# EAGLE design bike-blinky (EAGLE 6.4)
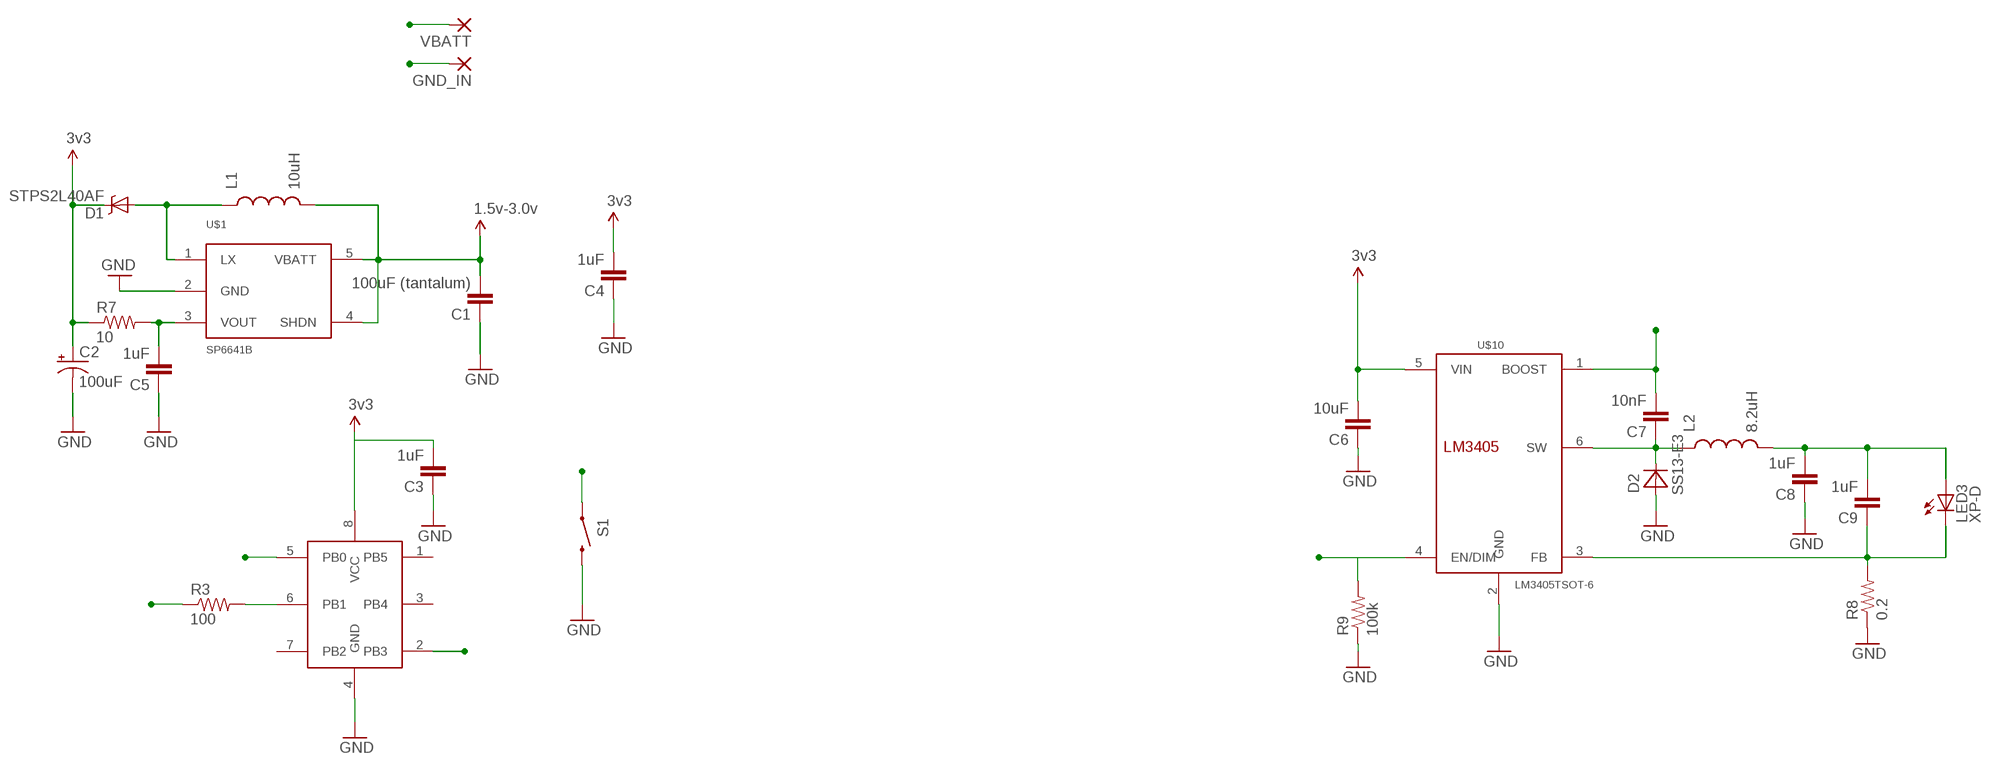
[diagram p0: schematic, sheet 1]

## Parts
C1  100uF (tantalum)  CAP1206  [1206]
C2  100uF  CAP_POLC  [PANASONIC_C]
C3  1uF  CAP0603-CAP  [0603-CAP]
C4  1uF  CAP0603-CAP  [0603-CAP]
C5  1uF  CAP0603-CAP  [0603-CAP]
C6  10uF  CAP1206  [1206]
C7  10nF  CAP0603-CAP  [0603-CAP]
C8  1uF  CAP0603-CAP  [0603-CAP]
C9  1uF  CAP0603-CAP  [0603-CAP]
D1  STPS2L40AF  MBRA140  [SMA-DIODE]
D2  SS13-E3  MBRA340T3  [SMA]
GND_IN  WIREPAD2,54/1,0  [2,54/1,0]
L1  10uH  INDUCTOR1007  [1007]
L2  8.2uH  INDUCTOR1210  [1210]
LED3  XP-D  XLAMP-XB-D-LED  [XB-D-REV1]
R3  100  RESISTOR0603-RES  [0603-RES]
R7  10  RESISTOR0603-RES  [0603-RES]
R8  0.2  RESISTOR2010  [R2010]
R9  100k  RESISTOR0603-RES  [0603-RES]
S1  SWITCH-MOMENTARY-2SMD-2  [TACTILE_SWITCH_SMD-2]
U$1  SP6641B  SP6641SP6641A/B  [SOT23-5]
U$2  ATTINY13  [WSOIC-8]
U$10  LM3405TSOT-6  [TSOT-6]
VBATT  WIREPAD2,54/1,0  [2,54/1,0]

## Nets
5V: C2.+ C3.2 C4.2 C6.2 D1.C R7.1 U$2.8(VCC) U$10.5(VIN) ; supply symbol labelled 3v3
ENABLE: C7.2 U$2.2(PB3) U$10.1(BOOST)
GND: C1.1 C2.- C3.1 C4.1 C5.1 C6.1 C8.1 D2.A GND_IN.1(P) R8.1 R9.1 S1.1 U$1.2(GND) U$2.4(GND) U$10.2(GND)
N$2: R3.2 U$2.6(PB1)
N$3: D1.A L1.1 U$1.1(LX)
N$7: C5.2 R7.2 U$1.3(VOUT)
N$8: C9.1 LED3.C R8.2 U$10.3(FB)
N$12: C7.1 D2.C L2.1 U$10.6(SW)
N$13: C8.2 C9.2 L2.2 LED3.A
RED: R3.1 R9.2 U$10.4(EN/DIM)
SW: S1.2 U$2.5(PB0)
VBATT: C1.2 L1.2 U$1.4(SHDN) U$1.5(VBATT) VBATT.1(P) ; supply symbol labelled 1.5v-3.0v
Unconnected: U$2.1(PB5) U$2.3(PB4) U$2.7(PB2)

## Library data of the parts
C1 C3-C5 = SparkFun:CAP: Capacitor Standard 0603 ceramic capacitor, and 0.1" leaded capacitor.
C2 = SparkFun-Capacitors:CAP_POL: Capacitor Polarized These are standard SMD and PTH capacitors. Normally 10uF, 47uF, and 100uF in electrolytic and tantalum varieties. Always verify the external diameter of the through hole cap, it varies with capacity, voltage, and manufacturer. The EIA devices should be standard.
C6-C9 = SparkFun-Capacitors:CAP: Capacitor Standard 0603 ceramic capacitor, and 0.1" leaded capacitor.
D1 = SparkFun-DiscreteSemi:MBRA140: 40V, 1A Schottky rectifier SMA/DO-214AC package DIO-08053; PROD_ID: DIO-08053
D2 = diode:MBRA340T3: Surface Mount Schottky Power Rectifier Source: http://www.onsemi.com/pub_link/Collateral/MBRA340T3-D.PDF
GND_IN VBATT = wirepad:WIREPAD: Wire PAD connect wire on PCB
L1 L2 = SparkFun-Passives:INDUCTOR: Inductors Basic Inductor/Choke - 0603 and 1206. Footprints are not proven and vary greatly between part numbers.
LED3 = led_cree:XLAMP-XB-D-LED
R3 = SparkFun:RESISTOR: Resistor Basic schematic elements and footprints for 0603, 1206, and PTH resistors.
R7-R9 = SparkFun-Passives:RESISTOR: Resistor Basic schematic elements and footprints for 0603, 1206, and PTH resistors.
S1 = SparkFun-Electromechanical:SWITCH-MOMENTARY-2: Various NO switches- pushbuttons, reed, etc
U$1 = Sipex Custom:SP6641
U$2 = Synapseware:ATTINY13
U$10 = Synapseware:LM3405: LM3405 1.6MHz, 1A Constant Current Buck Regulator for Powering LEDs

## Board
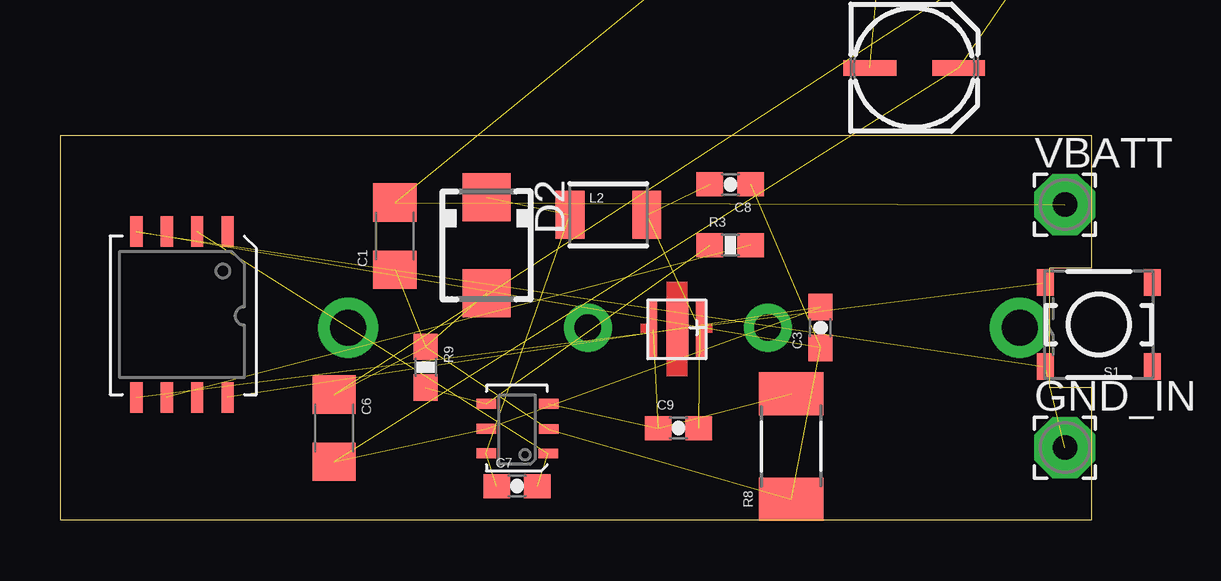
[diagram p1: board, top side]

Size 43.02 x 16.01 mm. Coordinates in mm from the lower left corner, seen from the top.
Outline: 43,16 43,10.5 41.26,10.5 41.26,5.5 43,5.5 43,0 0,0 0,16 43,16
Outline: 43,16 43.02,16.01
Copper layers (1*16): Top 0.035mm / dielectric 1.5mm / Bottom 0.035mm
Design rules "default": minimum track width 10mil, minimum drill 24mil, track to track 8mil, track to pad 8mil, pad to pad 8mil, via to via 8mil, smd to smd 8mil, copper to edge 40mil, drill to drill 8mil, minimum pad ring 10mil, minimum via ring 8mil, stop-mask expansion 4mil, vias tented up to drill 0mil, thermal gap 10mil

### Footprints (pad centres in the part's own frame; a part is rotated, then mirrored left to right if it is on the bottom)
1206 = smd 1.6 x 1.8: 1 -1.4,0; 2 1.4,0
PANASONIC_C = smd 2.2 x 0.65: + 1.9,-0.2; - -1.8,-0.2
0603-CAP = smd 1.1 x 1: 1 -0.85,0; 2 0.85,0
SMA-DIODE = smd 1.27 x 1.47: A -2.15,0; C 2.15,0
SMA = smd 2 x 2: A 2,0; C -2,0
2,54/1,0 = drill 1.016 pad 2.54 octagon: 1 0,0
1007 = smd 2 x 0.8: 1 0,1; 2 0,-1
1210 = smd 1.2 x 2: 1 -1.6,0; 2 1.6,0
XB-D-REV1 = smd 0.36 x 2.34: A 0.935,-0.075; C -1.035,-0.08 | smd 0.92 x 2.34: THERMAL -0.015,-0.075
0603-RES = smd 1.1 x 1: 1 -0.85,0; 2 0.85,0
R2010 = smd 1.8 x 2.7: 1 -2.2,0; 2 2.2,0
TACTILE_SWITCH_SMD-2 = smd 0.7 x 1.1: 1 2.225,1.75; 2 2.225,-1.75; 3 -2.225,-1.75; 4 -2.225,1.75
SOT23-5 = smd 0.7 x 1: 1 0.95,1.2; 2 0,1.2; 3 -0.95,1.2; 4 -1,-1.2; 5 1,-1.2
WSOIC-8 = smd 0.508 x 1.27: 1 -1.855,-3.486; 2 -0.585,-3.486; 3 0.685,-3.486; 4 1.955,-3.486; 5 1.955,3.413; 6 0.685,3.413; 7 -0.585,3.413; 8 -1.855,3.413
TSOT-6 = smd 0.406 x 0.813: 1 -1.06,-1.3; 2 -0.04,-1.32; 3 1.02,-1.32; 4 1.02,1.27; 5 -0.02,1.27; 6 -1.05,1.28

### Placement (x,y rotation side)
C1  13.96,11.81 90 top
C2  35.56,19.02 0 top
C3  31.7,8 90 top
C4  39.37,22.86 0 top  (outside the outline)
C5  36.83,24.13 90 top  (outside the outline)
C6  11.43,3.81 270 top
C7  19.05,1.4 0 top
C8  27.94,13.97 180 top
C9  25.78,3.81 0 top
D1  38.07,27.94 0 top  (outside the outline)
D2  17.78,11.43 270 top
GND_IN  41.89,3 0 top
L1  33.02,27.94 270 top  (outside the outline)
L2  22.86,12.7 0 top
LED3  25.75,8 0 top
R3  27.94,11.43 0 top
R7  39.37,25.4 180 top  (outside the outline)
R8  30.48,3.05 90 top
R9  15.24,6.35 270 top
S1  43.3,8.13 180 top
U$1  33.05,24.12 270 top  (outside the outline)
U$2  5.14,8.51 180 top
U$10  19.05,3.81 90 top
VBATT  41.89,13.13 0 top

### Tracks (layer width: path | path; a pad name or v marks a point on that pad's centre or on a via)
5V  (7 unrouted)
ENABLE  (2 unrouted)
GND  (14 unrouted)
N$1  (via drill 1.5 pad 2.5)
  other vias: 40,8
N$2  (1 unrouted)
N$3  (2 unrouted)
N$7  (2 unrouted)
N$8  (3 unrouted)
N$9  (via drill 1.1 pad 2)
  other vias: 29.5,8
N$10  (via drill 1.1 pad 2)
  other vias: 22,8
N$11  (via drill 1.5 pad 2.5)
  other vias: 12,8
N$12  (3 unrouted)
N$13  (3 unrouted)
RED  (2 unrouted)
SW  (1 unrouted)
VBATT  (4 unrouted)
(copper drawn outside any net)
  shapes: Top area x2